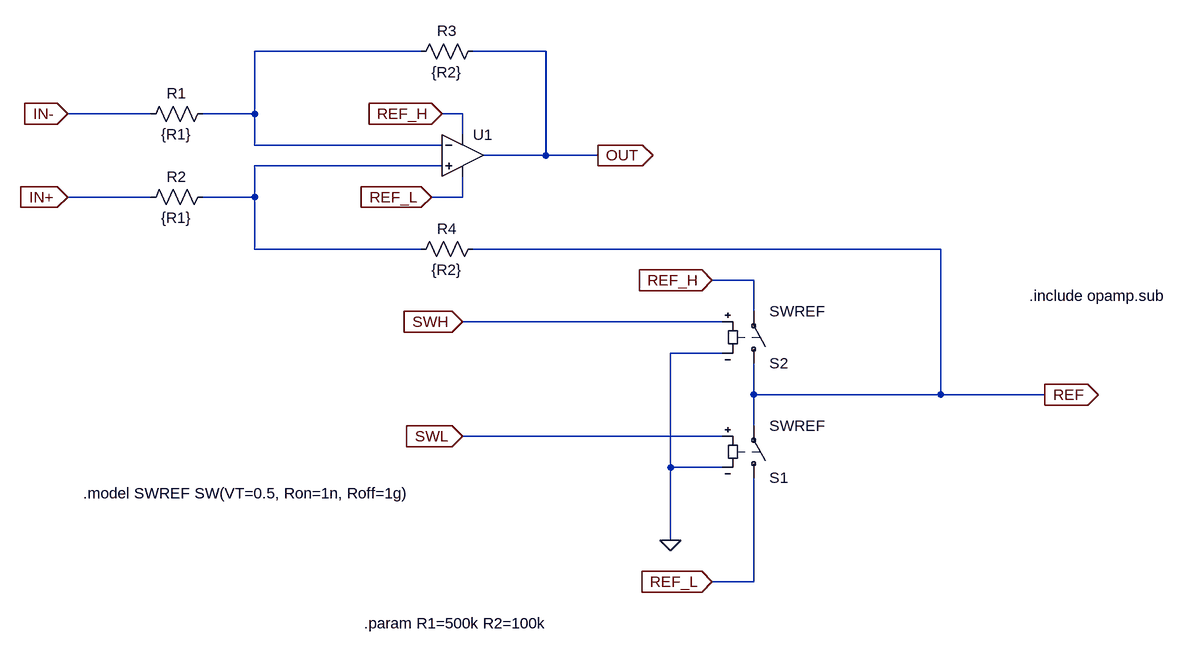
[diagram p0: schematic DiffAmp.asc]
DiffAmp.asc, the LTspice schematic file:
Version 4
SHEET 1 1452 988
WIRE 288 64 32 64
WIRE 480 64 368 64
WIRE -128 160 -256 160
WIRE 32 160 32 64
WIRE 32 160 -48 160
WIRE 352 160 320 160
WIRE 352 192 352 160
WIRE 32 208 32 160
WIRE 320 208 32 208
WIRE 480 224 480 64
WIRE 480 224 384 224
WIRE 560 224 480 224
WIRE 320 240 32 240
WIRE -128 288 -256 288
WIRE 32 288 32 240
WIRE 32 288 -48 288
WIRE 352 288 352 256
WIRE 352 288 304 288
WIRE 32 368 32 288
WIRE 288 368 32 368
WIRE 1088 368 368 368
WIRE 800 416 736 416
WIRE 800 464 800 416
WIRE 752 480 352 480
WIRE 752 528 672 528
WIRE 800 592 800 544
WIRE 1088 592 1088 368
WIRE 1088 592 800 592
WIRE 1248 592 1088 592
WIRE 800 640 800 592
WIRE 752 656 352 656
WIRE 672 704 672 528
WIRE 752 704 672 704
WIRE 672 816 672 704
WIRE 800 880 800 720
WIRE 800 880 736 880
FLAG -256 288 IN+
IOPIN -256 288 In
FLAG -256 160 IN-
IOPIN -256 160 In
FLAG 560 224 OUT
IOPIN 560 224 Out
FLAG 352 656 SWL
IOPIN 352 656 In
FLAG 352 480 SWH
IOPIN 352 480 In
FLAG 736 416 REF_H
IOPIN 736 416 In
FLAG 672 816 0
FLAG 736 880 REF_L
IOPIN 736 880 In
FLAG 1248 592 REF
IOPIN 1248 592 Out
FLAG 320 160 REF_H
IOPIN 320 160 In
FLAG 304 288 REF_L
IOPIN 304 288 In
SYMBOL res -32 144 R90
WINDOW 0 0 56 VBottom 2
WINDOW 3 32 56 VTop 2
SYMATTR InstName R1
SYMATTR Value {R1}
SYMBOL res 384 48 R90
WINDOW 0 0 56 VBottom 2
WINDOW 3 32 56 VTop 2
SYMATTR InstName R3
SYMATTR Value {R2}
SYMBOL res -32 272 R90
WINDOW 0 0 56 VBottom 2
WINDOW 3 32 56 VTop 2
SYMATTR InstName R2
SYMATTR Value {R1}
SYMBOL res 384 352 R90
WINDOW 0 0 56 VBottom 2
WINDOW 3 32 56 VTop 2
SYMATTR InstName R4
SYMATTR Value {R2}
SYMBOL sw 800 736 M180
SYMATTR InstName S1
SYMATTR Value SWREF
SYMBOL sw 800 560 M180
SYMATTR InstName S2
SYMATTR Value SWREF
SYMBOL Opamps\\UniversalOpamp2 352 224 R0
SYMATTR InstName U1
SYMATTR Value2 Avol=1Meg GBW=1000Meg Slew=1000Meg
TEXT -232 744 Left 2 !.model SWREF SW(VT=0.5, Ron=1n, Roff=1g)
TEXT 200 944 Left 2 !.param R1=500k R2=100k
TEXT 1224 440 Left 2 !.include opamp.sub

The netlist it stands for:
* DiffAmp.asc
R1 N001 IN- {R1}
R3 OUT N001 {R2}
R2 N002 IN+ {R1}
R4 REF N002 {R2}
S1 REF_L REF SWL 0 SWREF
S2 REF REF_H SWH 0 SWREF
XU1 N002 N001 REF_H REF_L OUT level.2 Avol=1Meg GBW=1000Meg Slew=1000Meg ilimit=25m rail=0 Vos=0 phimargin=45 en=0 enk=0 in=0 ink=0 Rin=500Meg  ; pins IN+ IN- V+ V- OUT
.model SWREF SW(VT=0.5, Ron=1n, Roff=1g)
.param R1=500k R2=100k
.include opamp.sub
.lib UniversalOpamps2.sub
.backanno
.end